# EAGLE design circuit-board (EAGLE 8.1.0)
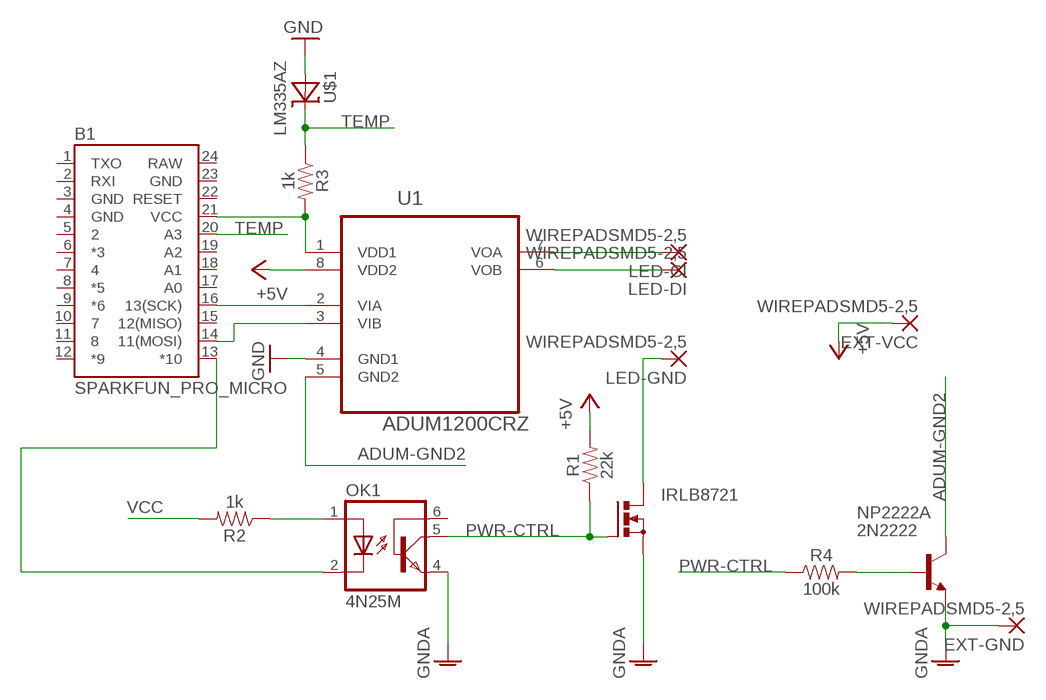
[diagram p0: schematic, sheet 1]

## Parts
B1  SPARKFUN_PRO_MICRO  [SPARKFUN_PRO_MICRO]
EXT-GND  WIREPADSMD5-2,5  [5-2,5]
EXT-VCC  WIREPADSMD5-2,5  [5-2,5]
IRLB8721  PMOSFET_NTO220BH  [TO220BH]
LED-CI  WIREPADSMD5-2,5  [5-2,5]
LED-DI  WIREPADSMD5-2,5  [5-2,5]
LED-GND  WIREPADSMD5-2,5  [5-2,5]
NP2222A  2N2222  [TO92-EBC-OVAL]
OK1  4N25M  [DIL06]
R1  22k  22KOHM-0603-1/10W-1%  [0603]
R2  1k  1KOHM-0603-1/10W-1%  [0603]
R3  1k  1KOHM-0603-1/10W-1%  [0603]
R4  100k  100KOHM-0603-1/10W-1%  [0603]
U1  ADUM1200CRZ  [SOIC127P600X175-8N]
U$1  LM335AZ  [TO92-]

## Nets
+5V: EXT-VCC.1(P) R1.2 U1.8(VDD2)
ADUM-GND2: NP2222A.C U1.5(GND2)
GND: U1.4(GND1) U$1.1(A)
GNDA: EXT-GND.1(P) IRLB8721.S NP2222A.E OK1.4(EMI)
N$1: LED-DI.1(P) U1.6(VOB)
N$2: NP2222A.B R4.2
N$3: IRLB8721.D LED-GND.1(P)
N$4: OK1.1(A) R2.1
N$5: B1.14(11(MOSI)) U1.3(VIB)
N$6: B1.16(13(SCK)) U1.2(VIA)
N$7: LED-CI.1(P) U1.7(VOA)
N$8: B1.13(*10) OK1.2(C)
PWR-CTRL: IRLB8721.G OK1.5(COL) R1.1 R4.1
TEMP: B1.20(A3) R3.1 U$1.2(C)
VCC: B1.21(VCC) R2.2 R3.2 U1.1(VDD1)
Unconnected: B1.1(TXO) B1.2(RXI) B1.5 B1.6(*3) B1.7 B1.8(*5) B1.9(*6) B1.10 B1.11 B1.12(*9) B1.15(12(MISO)) B1.17(A0) B1.18(A1) B1.19(A2) B1.22(RESET) OK1.6(BAS)

## Power pins joined to a net without a drawn wire
GND: B1.3(GND) B1.4(GND) B1.23(GND)
RAW: B1.24(RAW)

## Library data of the parts
B1 = SparkFun-Boards:SPARKFUN_PRO_MICRO: SparkFun Pro Micro Atmega32U4 compatible footprint. SparkFun Products: 3.3V/8MHz <https://www.sparkfun.com/products/12587> 5V/16MHz <https://www.sparkfun.com/products/12640>
EXT-GND EXT-VCC LED-CI LED-DI LED-GND = wirepad:WIREPAD: Wire PAD connect wire on PCB
IRLB8721 = transistor-power:PMOSFET_N: Power MOSFET N-Channel
NP2222A = adafruit:2N2222: NPN TRANSISTOR Big oval pads
OK1 = optocoupler:4N*?M: General Purpose 6-Pin Phototransistor Optocouplers Source: http://www.fairchildsemi.com/ds/4N/4N35-M.pdf; MPN: 4N25-M; OC_FARNELL: 1021349; OC_NEWARK: 98K9084
R1 = SparkFun-Resistors:22KOHM: 22kΩ resistor A resistor is a passive two-terminal electrical component that implements electrical resistance as a circuit element. Resistors act to reduce current flow, and, at the same time, act to lower voltage levels within circuits. - Wikipedia; PROD_ID: RES-07853
R2 R3 = SparkFun-Resistors:1KOHM: 1kΩ resistor A resistor is a passive two-terminal electrical component that implements electrical resistance as a circuit element. Resistors act to reduce current flow, and, at the same time, act to lower voltage levels within circuits. - Wikipedia; PROD_ID: RES-07856
R4 = SparkFun-Resistors:100KOHM: 100kΩ resistor A resistor is a passive two-terminal electrical component that implements electrical resistance as a circuit element. Resistors act to reduce current flow, and, at the same time, act to lower voltage levels within circuits. - Wikipedia; PROD_ID: RES-07828
U1 = Analog Devices_By_element14_Batch_1:ADUM1200CRZ: Dual-Channel Digital Isolators; MPN: ADUM1200CRZ; OC_FARNELL: 1078206; OC_NEWARK: 19M0752; PACKAGE: SOIC-8; SUPPLIER: Analog Devices
U$1 = pmandal:LM335AZ

## Board
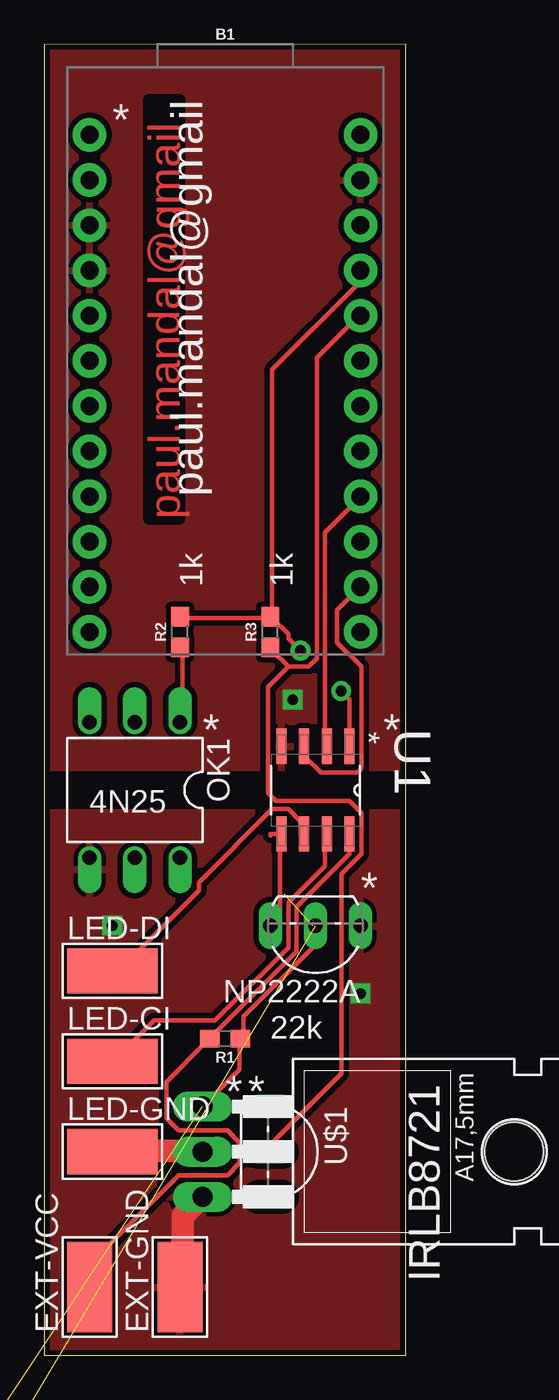
[diagram p1: board, top side]
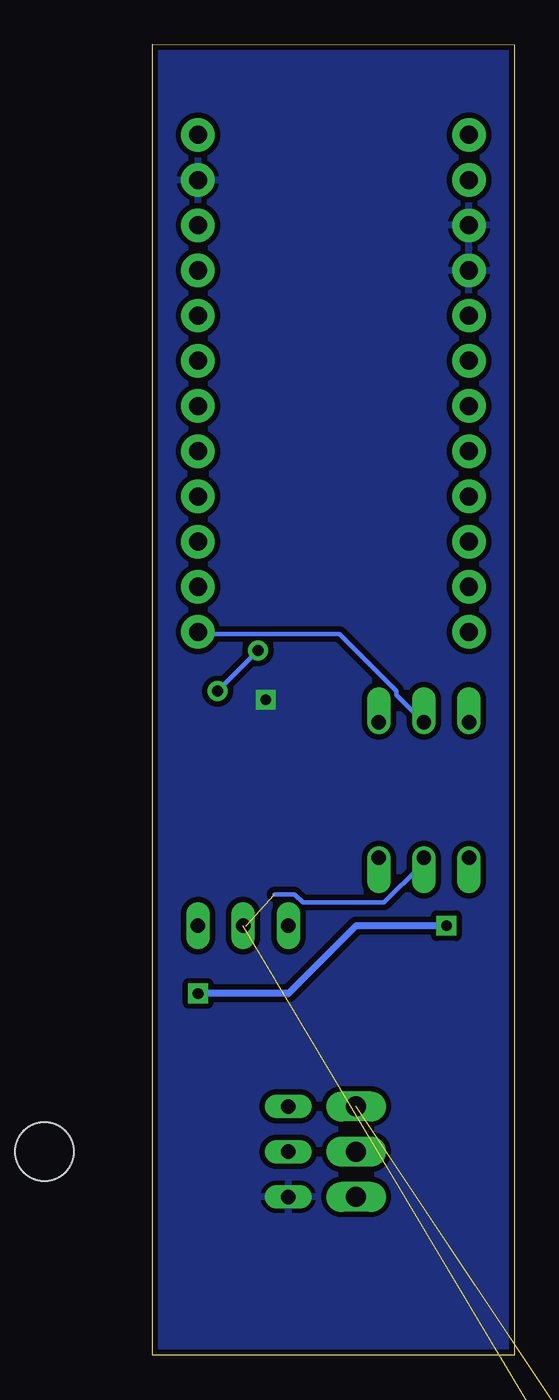
[diagram p2: board, bottom side, seen from below]

Size 20.32 x 73.66 mm. Coordinates in mm from the lower left corner, seen from the top.
Outline: 0,0 20.32,0 20.32,73.66 0,73.65 0,0
Copper layers (1*16): Top 0.035mm / dielectric 1.5mm / Bottom 0.035mm
Design rules "SparkFun-2-layer-STANDARD": minimum track width 10mil, minimum drill 20mil, track to track 10mil, track to pad 8mil, pad to pad 8mil, via to via 10mil, smd to smd 8mil, copper to edge 8mil, drill to drill 8mil, minimum pad ring 10mil, minimum via ring 10mil, stop-mask expansion 4mil, vias tented up to drill 25mil, thermal gap 10mil

### Footprints (pad centres in the part's own frame; a part is rotated, then mirrored left to right if it is on the bottom)
SPARKFUN_PRO_MICRO = drill 1.016 pad 1.88: 1 -7.62,12.7; 2 -7.62,10.16; 3 -7.62,7.62; 4 -7.62,5.08; 5 -7.62,2.54; 6 -7.62,0; 7 -7.62,-2.54; 8 -7.62,-5.08; 9 -7.62,-7.62; 10 -7.62,-10.16; 11 -7.62,-12.7; 12 -7.62,-15.24; 13 7.62,-15.24; 14 7.62,-12.7; 15 7.62,-10.16; 16 7.62,-7.62; 17 7.62,-5.08; 18 7.62,-2.54; 19 7.62,0; 20 7.62,2.54; 21 7.62,5.08; 22 7.62,7.62; 23 7.62,10.16; 24 7.62,12.7
5-2,5 = smd 2.54 x 5.08: 1 0,0
TO220BH = drill 1.118 long: D 0,-6.35; G -2.54,-6.35; S 2.54,-6.35 | hole 3.302: 0,11.176
TO92-EBC-OVAL = drill 0.813 long: B 0,-1.27; C 2.54,-1.27; E -2.54,-1.27
DIL06 = drill 0.813 offset: 1 -2.54,-3.81; 2 0,-3.81; 3 2.54,-3.81; 4 2.54,3.81; 5 0,3.81; 6 -2.54,3.81
0603 = smd 1.1 x 1: 1 -0.85,0; 2 0.85,0
SOIC127P600X175-8N = smd 1.981 x 0.559: 1 -2.464,1.905; 2 -2.464,0.635; 3 -2.464,-0.635; 4 -2.464,-1.905; 5 2.464,-1.905; 6 2.464,-0.635; 7 2.464,0.635; 8 2.464,1.905
TO92- = drill 0.813 long: 1 1.27,0; 2 -1.27,0; 3 -3.81,0

### Placement (x,y rotation side)
B1  10.16,55.88 0 top
EXT-GND  7.62,3.81 0 top
EXT-VCC  2.54,3.81 0 top
IRLB8721  15.24,11.43 270 top
LED-CI  3.81,16.51 270 top
LED-DI  3.81,21.59 270 top
LED-GND  3.81,11.43 270 top
NP2222A  15.24,22.86 180 top
OK1  5.08,31.75 180 top
R1  10.16,17.78 180 top
R2  7.62,40.64 90 top
R3  12.7,40.64 90 top
R4  -3.81,-6.35 0 top  (outside the outline)
U1  15.24,31.75 270 top
U$1  12.7,10.16 270 top

### Tracks (layer width: path | path; a pad name or v marks a point on that pad's centre or on a via)
+5V
  Top 0.254: U1.8 17.14,28.17 14.17,25.2 14.17,22.68 9.37,17.88 9.37,17.78 R1.2 9.14,17.78 9.14,17.65 6.86,15.37 6.86,13.31 7.54,12.62 10.29,12.62 10.97,11.94 10.97,10.79 10.29,10.11 7.54,10.11 2.74,5.31 2.74,3.81 EXT-VCC.1
ADUM-GND2
  Top 0.254: NP2222A.C 12.8,24.13 12.8,24.28 13.26,24.74 13.26,29.29 U1.5 12.7,29.29 12.7,29.21
GND  (via drill 0.6)
  other vias: 13.97,36.83
  pour Top (isolate 0.305): 0,33.02 20.32,33.02 20.32,73.66 0,73.66
  pour Bottom (isolate 0.305): 0,73.66 20.32,73.66 20.32,0 0,0
GNDA  (via drill 0.6)
  Top 0.254: EXT-GND.1 7.77,3.81 7.77,3.94
  Top 1.27: 7.77,3.94 7.77,7.82 8.69,8.74
  Bottom 0.406: v3.81,24.13 8.89,24.13 12.7,20.32 v17.78,20.32
  pour Top (isolate 0.305): 0,0 20.32,0 20.32,30.48 0,30.48
N$1
  Top 0.254: LED-DI.1 3.89,21.59 3.89,21.77 4.34,21.77 8.69,26.11 8.69,26.57 12.8,30.68 13.72,30.68 14.4,30 14.4,29.29 U1.6
N$2  (1 unrouted)
N$3
  Top 0.254: IRLB8721.D 8.69,11.43 8.69,11.48 | LED-GND.1 3.89,11.43 3.89,11.48
  Top 1.27: 3.89,11.48 8.69,11.48
N$4
  Top 0.254: 7.77,39.37 7.77,35.71 OK1.1 | 7.77,39.37 7.77,39.6 | R2.1 7.77,39.79 7.77,39.37
N$5
  Top 0.254: B1.14 17.6,43.18 17.6,43.03 16.46,41.88 16.46,40.06 17.83,38.68 17.83,32.97 17.6,32.74 15.54,32.74 14.63,33.66 14.63,34.21 U1.3
N$6
  Top 0.254: B1.16 17.6,48.26 17.6,48.06 15.77,46.23 15.77,34.21 U1.2
N$7
  Top 0.254: LED-CI.1 3.89,16.51 6.17,18.8 9.6,18.8 13.72,22.91 13.72,25.42 15.77,27.48 15.77,29.29 U1.7
N$8
  Bottom 0.254: B1.13 17.6,40.64 17.6,40.51 9.83,40.51 6.63,37.31 6.63,37.08 5.26,35.71 5.26,35.56 OK1.2
PWR-CTRL  (2 unrouted)
  Top 0.254: IRLB8721.G 10.97,16.05 10.97,17.78 R1.1 11.2,17.78 11.2,19.02 15.09,22.91 15.09,24.13
  Bottom 0.254: 13.49,25.88 12.34,25.88 11.89,25.42 7.32,25.42 5.26,27.48 5.26,27.94 OK1.5
TEMP
  Top 0.254: 13.72,38.68 12.8,39.6 12.8,39.79 R3.1 | 13.72,38.68 14.86,38.68 15.32,39.14 15.32,56.06 17.6,58.34 | 13.72,38.68 12.57,37.54 12.57,31.6 13.03,31.14 17.14,31.14 17.83,30.45 17.83,28.17 16.69,27.03 16.69,15.82 12.8,11.94 12.8,11.43 U$1.2
  Top 0.305: B1.20 17.6,58.42 17.6,58.34
VCC  (via drill 0.61)
  Top 0.254: U1.1 17.14,36.85 v16.69,37.31 | v14.4,39.6 13.72,40.28 13.72,40.51 12.8,41.43 12.8,41.49 | 12.8,41.91 12.8,41.66 | 12.8,41.91 12.8,55.37 17.6,60.17 17.6,60.96 B1.21 | R2.2 7.77,41.49 7.77,41.43 12.57,41.43 12.57,41.49 R3.2 | 12.8,41.49 R3.2 | 12.8,41.49 12.8,41.91 | R3.2 12.8,41.49
  Bottom 0.254: v14.4,39.6 v16.69,37.31

### Text on the board
Top: paul.mandal@gmail
tPlace: * | paul.mandal@gmail | 1k | 1k | * | * | 4N25 | * | 22k | * | *